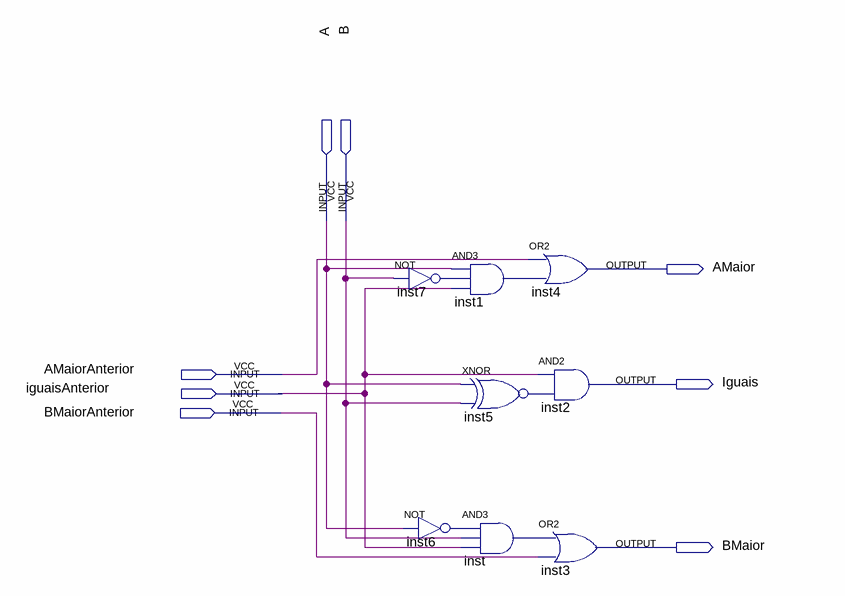
[diagram p0: schematic sheet]
// Quartus schematic ComparadordMag1BComp.bdf as structural Verilog: 8 symbols, 8 pins
module ComparadordMag1BComp (
  input  A,
  input  B,
  input  AMaiorAnterior,
  input  iguaisAnterior,
  input  BMaiorAnterior,
  output AMaior,
  output Iguais,
  output BMaior
);

  wire inst1_out, inst5_out, inst6_out, inst7_out, inst_out;

  not inst7 (inst7_out, B);
  not inst6 (inst6_out, A);
  and inst1 (inst1_out, A, inst7_out, iguaisAnterior);
  xnor inst5 (inst5_out, A, B);
  and inst (inst_out, inst6_out, B, iguaisAnterior);
  or inst4 (AMaior, AMaiorAnterior, inst1_out);
  and inst2 (Iguais, iguaisAnterior, inst5_out);
  or inst3 (BMaior, inst_out, BMaiorAnterior);
endmodule
